# EAGLE schematic csa_drvio_v1.0a (EAGLE 4.15)
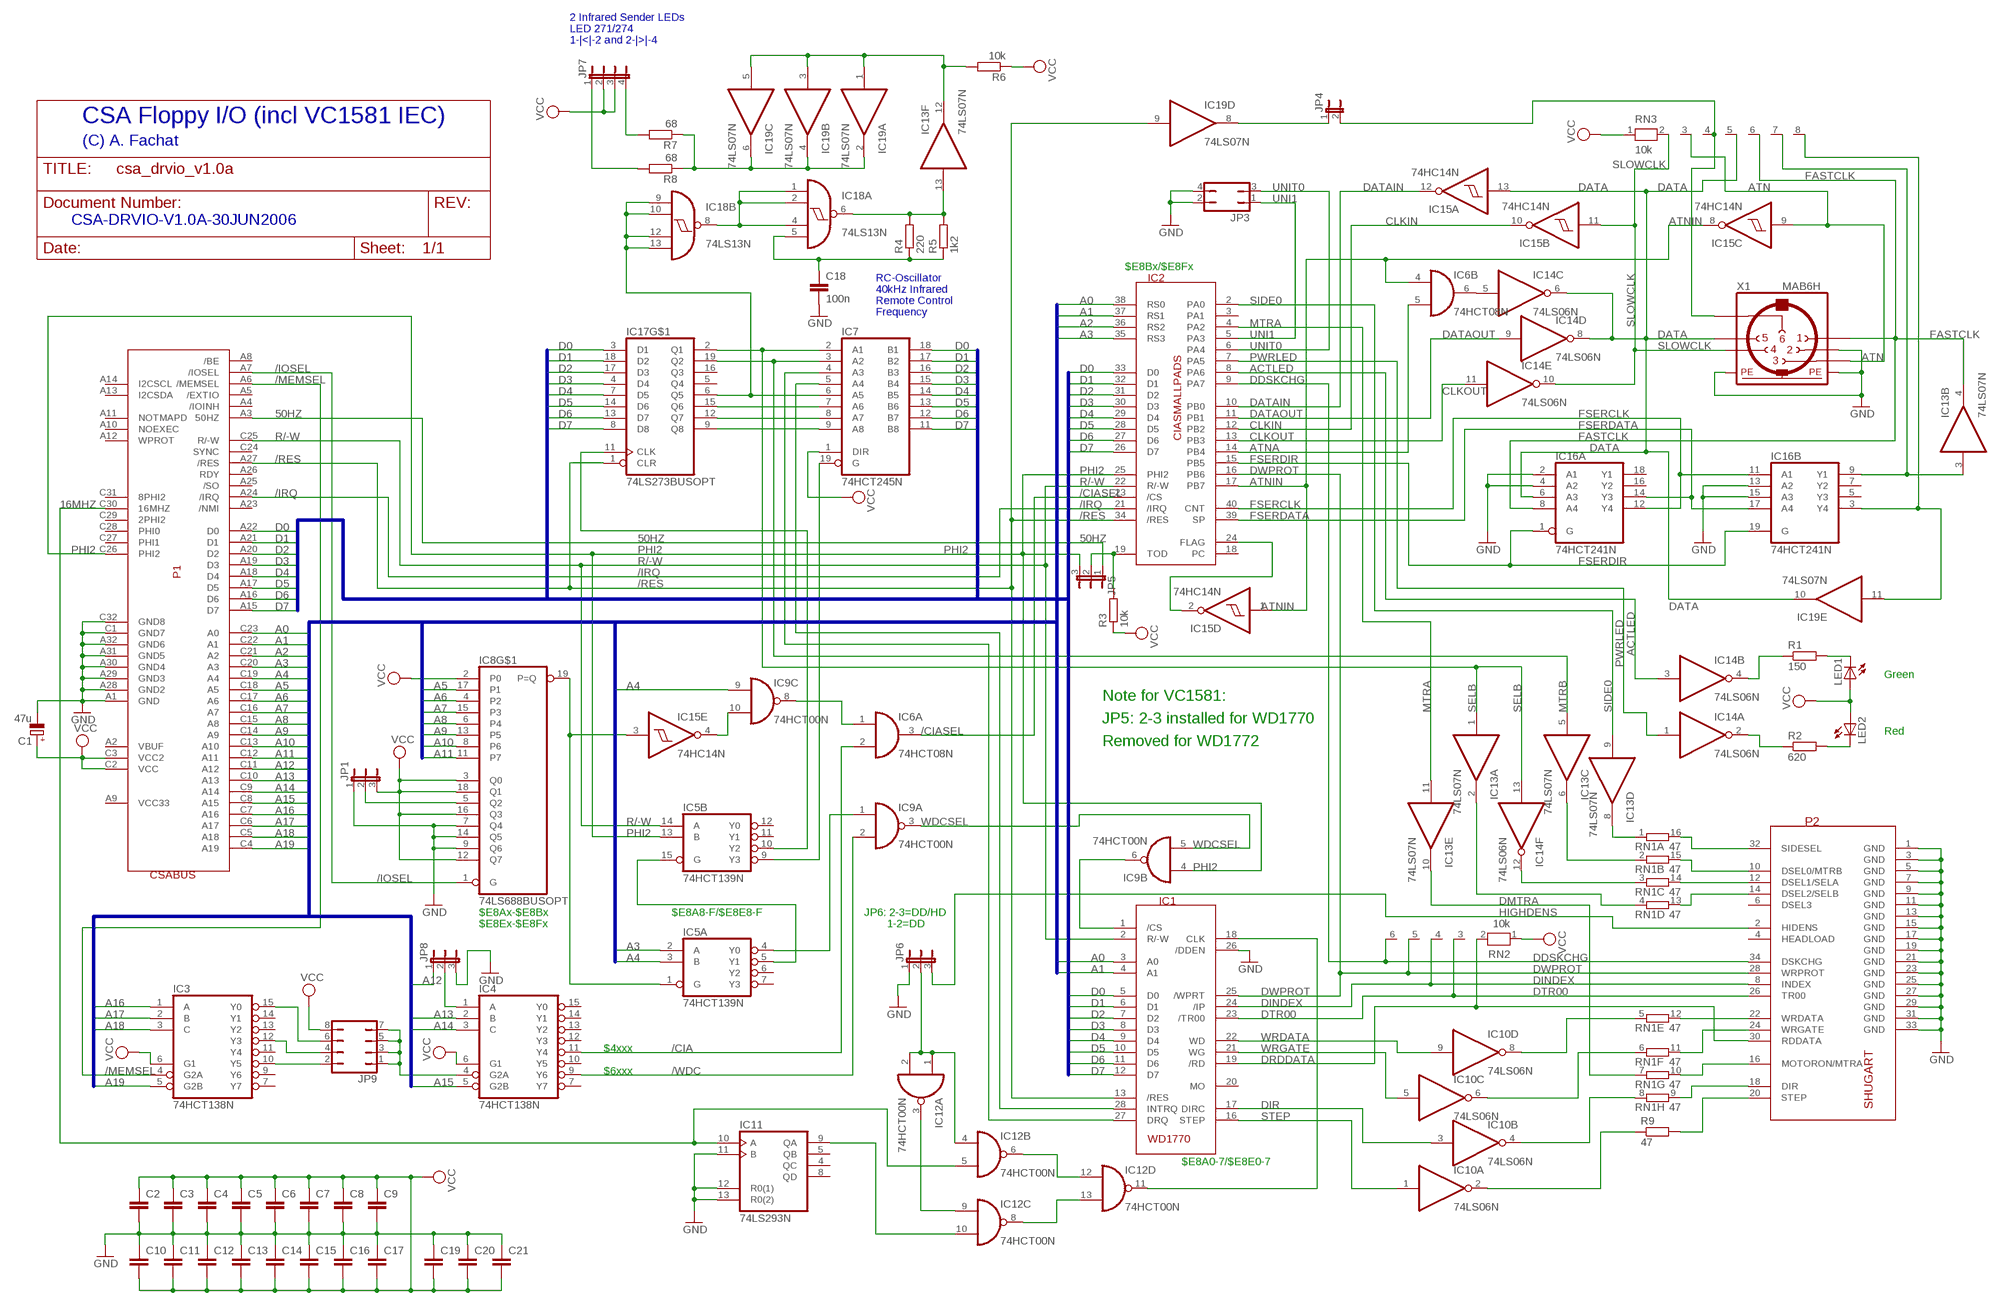
[diagram p0: schematic, sheet 1]

## Parts
C1  47u  CPOL-EUE2.5-5  [E2,5-5]
C2  C-EU025-025X050  [C025-025X050]
C3  C-EU025-025X050  [C025-025X050]
C4  C-EU025-025X050  [C025-025X050]
C5  C-EU025-025X050  [C025-025X050]
C6  C-EU025-025X050  [C025-025X050]
C7  C-EU025-025X050  [C025-025X050]
C8  C-EU025-025X050  [C025-025X050]
C9  C-EU025-025X050  [C025-025X050]
C10  C-EU025-025X050  [C025-025X050]
C11  C-EU025-025X050  [C025-025X050]
C12  C-EU025-025X050  [C025-025X050]
C13  C-EU025-025X050  [C025-025X050]
C14  C-EU025-025X050  [C025-025X050]
C15  C-EU025-025X050  [C025-025X050]
C16  C-EU025-025X050  [C025-025X050]
C17  C-EU025-025X050  [C025-025X050]
C18  100n  C-EU050-025X075  [C050-025X075]
C19  C-EU025-025X050  [C025-025X050]
C20  C-EU025-025X050  [C025-025X050]
C21  C-EU025-025X050  [C025-025X050]
IC1  WD1770  [DIL28]
IC2  CIASMALLPADS  [DIP40]
IC3  74HCT138N  [DIL16]
IC4  74HCT138N  [DIL16]
IC5  74HCT139N  [DIL16]
IC6  74HCT08N  [DIL14]
IC7  74HCT245N  [DIL20]
IC8  74LS688BUSOPT  [DIL20]
IC9  74HCT00N  [DIL14]
IC10  74LS06N  [DIL14]
IC11  74LS293N  [DIL14]
IC12  74HCT00N  [DIL14]
IC13  74LS07N  [DIL14]
IC14  74LS06N  [DIL14]
IC15  74HC14N  [DIL14]
IC16  74HCT241N  [DIL20]
IC17  74LS273BUSOPT  [DIL20]
IC18  74LS13N  [DIL14]
IC19  74LS07N  [DIL14]
JP1  JP2E  [JP2]
JP3  JP2Q  [JP2Q]
JP4  JP1E  [JP1]
JP5  JP2E  [JP2]
JP6  JP2E  [JP2]
JP7  JP4E  [JP4]
JP8  JP2E  [JP2]
JP9  JP4Q  [JP4Q]
LED1  LED5MM  [LED5MM]
LED2  LED5MM  [LED5MM]
P1  CSABUS  [CSABUS]
P2  SHUGART  [CON34]
R1  150  R-EU_0207/10  [0207/10]
R2  620  R-EU_0207/10  [0207/10]
R3  10k  R-EU_0204/7  [0204/7]
R4  220  R-EU_0207/10  [0207/10]
R5  1k2  R-EU_0207/10  [0207/10]
R6  10k  R-EU_0207/10  [0207/10]
R7  68  R-EU_0207/10  [0207/10]
R8  68  R-EU_0207/10  [0207/10]
R9  47  R-EU_0207/10  [0207/10]
RN1  47  8R-N  [DIL16]
RN2  10k  RN05  [RN-6]
RN3  10k  RN07  [RN-8]
X1  MAB6H  [MAB6H]

## Nets
16MHZ: IC11.10(A) IC12.5(B:I1) P1.C30(16MHZ)
50HZ: JP5.1 P1.A3(50HZ)
/CIA: IC4.11(Y4) IC6.2(A:I1)
/CIASEL: IC2.23(/CS) IC6.3(A:O)
/IOSEL: IC8.1(G) P1.A7(/IOSEL)
/IRQ: IC2.21(/IRQ) P1.A24(/IRQ)
/MEMSEL: IC3.4(G2A) P1.A6(/MEMSEL)
/RES: IC1.13(/RES) IC2.34(/RES) IC17.1(CLR) IC19.9(D:I) P1.A27(/RES)
/WDC: IC4.9(Y6) IC9.2(A:I1)
A0: IC1.3(A0) IC2.38(RS0) P1.C23(A0)
A1: IC1.4(A1) IC2.37(RS1) P1.C22(A1)
A2: IC2.36(RS2) P1.C21(A2)
A3: IC2.35(RS3) IC5.2(A:A) P1.C20(A3)
A4: IC5.3(A:B) IC9.9(C:I0) P1.C19(A4)
A5: IC8.17(P1) P1.C18(A5)
A6: IC8.4(P2) P1.C17(A6)
A7: IC8.15(P3) P1.C16(A7)
A8: IC8.6(P4) P1.C15(A8)
A9: IC8.13(P5) P1.C14(A9)
A10: IC8.8(P6) P1.C13(A10)
A11: IC8.11(P7) P1.C12(A11)
A12: JP8.1 P1.C11(A12)
A13: IC4.2(B) P1.C10(A13)
A14: IC4.3(C) P1.C9(A14)
A15: IC4.5(G2B) P1.C8(A15)
A16: IC3.1(A) P1.C7(A16)
A17: IC3.2(B) P1.C6(A17)
A18: IC3.3(C) P1.C5(A18)
A19: IC3.5(G2B) P1.C4(A19)
ACTLED: IC2.8(PA6) IC14.3(B:I)
ATN: IC15.9(C:I) RN3.3 X1.3
ATNA: IC2.14(PB4) IC6.5(B:I1)
ATNIN: IC2.17(PB7) IC6.4(B:I0) IC15.1(D:I) IC15.8(C:O)
CLKIN: IC2.12(PB2) IC15.10(B:O)
CLKOUT: IC2.13(PB3) IC14.11(E:I)
D0: IC1.5(D0) IC2.33(D0) IC7.18(B1) IC17.3(D1) P1.A22(D0)
D1: IC1.6(D1) IC2.32(D1) IC7.17(B2) IC17.18(D2) P1.A21(D1)
D2: IC1.7(D2) IC2.31(D2) IC7.16(B3) IC17.17(D3) P1.A20(D2)
D3: IC1.8(D3) IC2.30(D3) IC7.15(B4) IC17.4(D4) P1.A19(D3)
D4: IC1.9(D4) IC2.29(D4) IC7.14(B5) IC17.7(D5) P1.A18(D4)
D5: IC1.10(D5) IC2.28(D5) IC7.13(B6) IC17.14(D6) P1.A17(D5)
D6: IC1.11(D6) IC2.27(D6) IC7.12(B7) IC17.13(D7) P1.A16(D6)
D7: IC1.12(D7) IC2.26(D7) IC7.11(B8) IC17.8(D8) P1.A15(D7)
DATA: IC14.6(C:O) IC14.8(D:O) IC15.13(A:I) IC16.6(A:A3) IC19.10(E:O) RN3.5 X1.5
DATAIN: IC2.10(PB0) IC15.12(A:O)
DATAOUT: IC2.11(PB1) IC14.9(D:I)
DDSKCHG: IC2.9(PA7) P2.34(DSKCHG) RN2.6
DINDEX: IC1.24(/IP) P2.8(INDEX) RN2.4
DIR: IC1.17(DIRC) IC10.3(B:I)
DMTRA: IC13.10(E:O) RN1.7
DMTRB: IC13.6(C:O) RN1.2
DRDDATA: IC1.19(/RD) P2.30(RDDATA) RN2.2
DSEL1: IC14.12(F:O) RN1.3
DSELB: IC13.2(A:O) RN1.4
DTR00: IC1.23(/TR00) P2.26(TR00) RN2.3
DWPROT: IC1.25(/WPRT) IC2.16(PB6) P2.28(WRPROT) RN2.5
FASTCLK: IC13.4(B:O) IC16.8(A:A4) RN3.6 X1.1
FSERCLK: IC2.40(CNT) IC16.11(B:A1) IC16.12(A:Y4)
FSERDATA: IC2.39(SP) IC16.14(A:Y3) IC16.17(B:A4)
FSERDIR: IC2.15(PB5) IC16.1(A:G) IC16.19(B:G)
GND: C1.- C2.2 C3.2 C4.2 C5.2 C6.2 C7.2 C8.2 C9.2 C10.1 C11.1 C12.1 C13.1 C14.1 C15.1 C16.1 C17.1 C18.2 C19.1 C20.1 C21.1 IC1.26(/DDEN) IC8.7(Q4) IC8.9(Q6) IC8.14(Q5) IC11.11(B) IC11.12(R0(1)) IC11.13(R0(2)) IC16.2(A:A1) IC16.4(A:A2) IC16.13(B:A2) IC16.15(B:A3) JP1.1 JP3.2 JP3.4 JP6.1 JP8.3 P1.A1(GND) P1.A28(GND2) P1.A29(GND3) P1.A30(GND4) P1.A31(GND5) P1.A32(GND6) P1.C1(GND7) P1.C32(GND8) P2.1(GND) P2.3(GND) P2.5(GND) P2.7(GND) P2.9(GND) P2.11(GND) P2.13(GND) P2.15(GND) P2.17(GND) P2.19(GND) P2.21(GND) P2.23(GND) P2.25(GND) P2.27(GND) P2.29(GND) P2.31(GND) P2.33(GND) X1.2 X1.PE X1.PE@(PE)
HIGHDENS: JP6.3 P2.2(HIDENS)
MTRA: IC2.4(PA2) IC13.11(E:I)
MTRB: IC7.3(A2) IC13.5(C:I) IC17.19(Q2)
N$1: IC3.15(Y0) JP9.6
N$2: IC3.10(Y5) JP9.2
N$3: IC4.4(G2A) JP9.1 JP9.3 JP9.5 JP9.7
N$4: IC5.4(A:Y0) IC9.1(A:I0)
N$5: IC3.12(Y3) JP9.4
N$6: IC5.1(A:G) IC8.19(P=Q) IC15.3(E:I)
N$8: IC5.5(A:Y1) IC5.15(B:G)
N$9: IC5.10(B:Y2) IC17.11(CLK)
N$10: IC1.1(/CS) IC9.6(B:O)
N$11: IC8.5(Q2) JP1.2
N$12: IC6.1(A:I0) IC9.8(C:O)
N$13: JP4.2 RN3.4 X1.6
N$14: IC9.10(C:I1) IC15.4(E:O)
N$15: IC19.8(D:O) JP4.1
N$16: IC10.2(A:O) R9.1
N$17: IC10.4(B:O) RN1.8
N$18: IC12.1(A:I0) IC12.2(A:I1) IC12.4(B:I0) JP6.2
N$19: IC10.8(D:O) RN1.5
N$20: IC10.6(C:O) RN1.6
N$21: IC2.19(TOD) JP5.2 R3.2
N$22: IC1.28(INTRQ) IC7.5(A4)
N$23: IC1.27(DRQ) IC7.4(A3)
N$24: IC18.1(A:I0) IC18.2(A:I1) IC18.4(A:I2) IC18.8(B:O)
N$25: P2.32(SIDESEL) RN1.16
N$26: IC7.9(A8) IC17.9(Q8)
N$27: IC7.8(A7) IC17.12(Q7)
N$28: IC11.9(QA) IC12.10(C:I1)
N$29: IC12.6(B:O) IC12.12(D:I0)
N$30: IC12.8(C:O) IC12.13(D:I1)
N$31: IC12.3(A:O) IC12.9(C:I0)
N$32: IC13.8(D:O) RN1.1
N$33: IC7.7(A6) IC17.15(Q6)
N$34: IC7.6(A5) IC17.6(Q5) IC18.9(B:I0) IC18.10(B:I1) IC18.12(B:I2) IC18.13(B:I3)
N$35: IC13.13(F:I) IC18.6(A:O) R4.2 R5.2
N$36: IC13.12(F:O) IC19.1(A:I) IC19.3(B:I) IC19.5(C:I) R6.2
N$37: IC19.2(A:O) IC19.4(B:O) IC19.6(C:O) R7.1 R8.1
N$38: JP7.4 R7.2
N$39: IC1.18(CLK) IC12.11(D:O)
N$40: JP7.1 R8.2
N$41: C18.1 IC18.5(A:I3) R4.1 R5.1
N$42: IC5.9(B:Y3) IC7.19(G)
N$43: P2.10(DSEL0/MTRB) RN1.15
N$44: IC14.4(B:O) R1.1
N$45: LED1.K(C) R1.2
N$46: LED2.K(C) R2.2
N$47: IC14.2(A:O) R2.1
N$48: P2.12(DSEL1/SELA) RN1.14
N$49: IC2.24(FLAG) IC15.2(D:O)
N$50: P2.14(DSEL2/SELB) RN1.13
N$51: IC6.6(B:O) IC14.5(C:I)
N$52: P2.22(WRDATA) RN1.12
N$53: P2.24(WRGATE) RN1.11
N$54: P2.16(MOTORON/MTRA) RN1.10
N$55: P2.18(DIR) RN1.9
N$56: P2.20(STEP) R9.2
N$57: IC4.1(A) JP8.2
N$58: IC13.3(B:I) IC16.9(B:Y1) RN3.7
N$59: IC16.3(B:Y4) IC19.11(E:I) RN3.8
PHI2: IC2.25(PHI2) IC5.13(B:B) IC9.4(B:I0) JP5.3 P1.C26(PHI2)
PWRLED: IC2.7(PA5) IC14.1(A:I)
R/-W: IC1.2(R/-W) IC2.22(R/-W) IC5.14(B:A) P1.C25(R/-W)
SELB: IC7.2(A1) IC13.1(A:I) IC14.13(F:I) IC17.2(Q1)
SIDE0: IC2.2(PA0) IC13.9(D:I)
SLOWCLK: IC14.10(E:O) IC15.11(B:I) RN3.2 X1.4
STEP: IC1.16(STEP) IC10.1(A:I)
UNI1: IC2.5(PA3) JP3.1
UNIT0: IC2.6(PA4) JP3.3
VCC: C1.+ C2.1 C3.1 C4.1 C5.1 C6.1 C7.1 C8.1 C9.1 C10.2 C11.2 C12.2 C13.2 C14.2 C15.2 C16.2 C17.2 C19.2 C20.2 C21.2 IC3.6(G1) IC4.6(G1) IC7.1(DIR) IC8.2(P0) IC8.3(Q0) IC8.12(Q7) IC8.16(Q3) IC8.18(Q1) JP1.3 JP7.2 JP7.3 JP9.8 LED1.A LED2.A P1.C2(VCC) P1.C3(VCC2) R3.1 R6.1 RN2.1 RN3.1
WDCSEL: IC9.3(A:O) IC9.5(B:I1)
WRDATA: IC1.22(WD) IC10.9(D:I)
WRGATE: IC1.21(WG) IC10.5(C:I)
Unconnected: IC1.20(MO) IC2.3(PA1) IC2.18(PC) IC3.7(Y7) IC3.9(Y6) IC3.11(Y4) IC3.13(Y2) IC3.14(Y1) IC4.7(Y7) IC4.10(Y5) IC4.12(Y3) IC4.13(Y2) IC4.14(Y1) IC4.15(Y0) IC5.6(A:Y2) IC5.7(A:Y3) IC5.11(B:Y1) IC5.12(B:Y0) IC6.8(C:O) IC6.9(C:I0) IC6.10(C:I1) IC6.11(D:O) IC6.12(D:I0) IC6.13(D:I1) IC9.11(D:O) IC9.12(D:I0) IC9.13(D:I1) IC10.10(E:O) IC10.11(E:I) IC10.12(F:O) IC10.13(F:I) IC11.4(QC) IC11.5(QB) IC11.8(QD) IC15.5(F:I) IC15.6(F:O) IC16.5(B:Y3) IC16.7(B:Y2) IC16.16(A:Y2) IC16.18(A:Y1) IC17.5(Q4) IC17.16(Q3) IC19.12(F:O) IC19.13(F:I) P1.A2(VBUF) P1.A4(/IOINH) P1.A5(/EXTIO) P1.A8(/BE) P1.A9(VCC33) P1.A10(NOEXEC) P1.A11(NOTMAPD) P1.A12(WPROT) P1.A13(I2CSDA) P1.A14(I2CSCL) P1.A23(/NMI) P1.A25(/SO) P1.A26(RDY) P1.C24(SYNC) P1.C27(PHI1) P1.C28(PHI0) P1.C29(2PHI2) P1.C31(8PHI2) P2.4(HEADLOAD) P2.6(DSEL3)

## Buses
D[0..7]
A[0..19]

## Notes on the sheet
- 2 Infrared Sender LEDs
- LED 271/274
- 1-|<|-2 and 2-|>|-4
- CSA Floppy I/O (incl VC1581 IEC)
- (C) A. Fachat
- CSA-DRVIO-V1.0A-30JUN2006
- $E8Bx/$E8Fx
- RC-Oscillator
- 40kHz Infrared
- Remote Control
- Frequency
- Green
- Note for VC1581:
- JP5: 2-3 installed for WD1770
- Red
- Removed for WD1772
- $E8Ax-$E8Bx | $E8A8-F/$E8E8-F | JP6: 2-3=DD/HD
- $E8Ex-$E8Fx | 1-2=DD
- $4xxx
- $6xxx
- $E8A0-7/$E8E0-7

## Power pins joined to a net without a drawn wire
GND: IC1.14(GND) IC2.1(GND) IC3.8(GND) IC4.8(GND) IC5.8(P:GND) IC6.7(P:GND) IC7.10(GND) IC8.10(GND) IC9.7(P:GND) IC10.7(P:GND) IC11.7(GND) IC12.7(P:GND) IC13.7(P:GND) IC14.7(P:GND) IC15.7(P:GND) IC16.10(P:GND) IC17.10(GND) IC18.7(P:GND) IC19.7(P:GND)
VCC: IC1.15(VCC) IC2.20(VCC) IC3.16(VCC) IC4.16(VCC) IC5.16(P:VCC) IC6.14(P:VCC) IC7.20(VCC) IC8.20(VCC) IC9.14(P:VCC) IC10.14(P:VCC) IC11.14(VCC) IC12.14(P:VCC) IC13.14(P:VCC) IC14.14(P:VCC) IC15.14(P:VCC) IC16.20(P:VCC) IC17.20(VCC) IC18.14(P:VCC) IC19.14(P:VCC)

## Library data of the parts
C1 = rcl:CPOL-EU: POLARIZED CAPACITOR, European symbol
C2-C21 = rcl:C-EU: CAPACITOR, European symbol
IC1 = csa:WD1770
IC2 = csa:CIA
IC3 IC4 = 74xx-eu:74*138: 3-line to 8-line DECODER/DEMULTIPLEXER
IC5 = 74xx-eu:74*139: Dual 2-line to 4-line DECODER/DEMULTIPLEXER
IC6 = 74xx-eu:74*08: Quad 2-input AND gate
IC7 = 74xx-eu:74*245: Octal BUS TRANSCEIVER, 3-state
IC8 = csa:74LS688BUSOPT
IC9 IC12 = 74xx-eu:74*00: Quad 2-input NAND gate
IC10 IC14 = 74xx-eu:74*06: Hex INVERTER, open collector high-voltage output
IC11 = 74xx-us:74*293: Decade and 4-bit BINARY COUNTER
IC13 IC19 = 74xx-eu:74*07: Hex BUFFER, open collector high-voltage output
IC15 = 74xx-eu:74*14: Hex schmitt trigger INVERTER
IC16 = 74xx-eu:74*241: Octal BUFFER and LINE DRIVER, 3-state
IC17 = csa:74LS273BUSOPT
IC18 = 74xx-eu:74*13: Dual 4-input NAND schmitt trigger
JP1 JP5 JP6 JP8 = jumper:JP2E: JUMPER
JP3 = jumper:JP2Q: JUMPER
JP4 = jumper:JP1E: JUMPER
JP7 = jumper:JP4E: JUMPER
JP9 = jumper:JP4Q: JUMPER
LED1 LED2 = led:LED: LED OSRAM: - CHIPLED LG R971, LG N971, LY N971, LG Q971, LY Q971, LO R971, LY R971 LH N974, LH R974 LS Q976, LO Q976, LY Q976 LO Q996 - Hyper CHIPLED LW Q18S LB Q993, LB Q99A, LB R99A - SideLED LS A670, LO A670, LY A670, LG A670, LP A670 LB A673, LV A673, LT A673, LW A673 LH A674 LY A675 LS A676, LA A676, LO A676, LY A676, LW A676 LS A679, LY A679, LG A679 - Hyper Micro SIDELED® LS Y876, LA Y876, LO Y876, LY Y876 LT Y87S - SmartLED LW L88C, LW L88S LB L89C, LB L89S, LG L890 LS L89K, LO L89K, LY L89K LS L896, LA L896, LO L896, LY L896 - TOPLED LS T670, LO T670, LY T670, LG T670, LP T670 LSG T670, LSP T670, LSY T670, LOP T670, LYG T670 LG T671, LOG T671, LSG T671 LB T673, LV T673, LT T673, LW T673 LH T674 LS T676, LA T676, LO T676, LY T676, LB T676, LH T676, LSB T676, LW T676 LB T67C, LV T67C, LT T67C, LS T67K, LO T67K, LY T67K, LW E67C LS E67B, LA E67B, LO E67B, LY E67B, LB E67C, LV E67C, LT E67C LW T67C LS T679, LY T679, LG T679 LS T770, LO T770, LY T770, LG T770, LP T770 LB T773, LV T773, LT T773, LW T773 LH T774 LS E675, LA E675, LY E675, LS T675 LS T776, LA T776, LO T776, LY T776, LB T776 LHGB T686 LT T68C, LB T68C - Hyper Mini TOPLED® LB M676 - Mini TOPLED Santana® LG M470 LS M47K, LO M47K, LY M47K Source: http://www.osram.convergy.de/
P1 = csa:CSABUS
P2 = csa:SHUGART
R1-R9 = rcl:R-EU_: RESISTOR, European symbol
RN1 = resistor-dil:8R-N: DIL RESISTOR
RN2 = resistor-net:RN05: RESISTOR NETWORK
RN3 = resistor-net:RN07: RESISTOR NETWORK
X1 = con-hirschmann:MAB6H: Female CONNECTOR 6 pins with shield, horizontal (DIN 45322)